# EAGLE schematic AP_Schematic_Final (EAGLE 9.6.2)
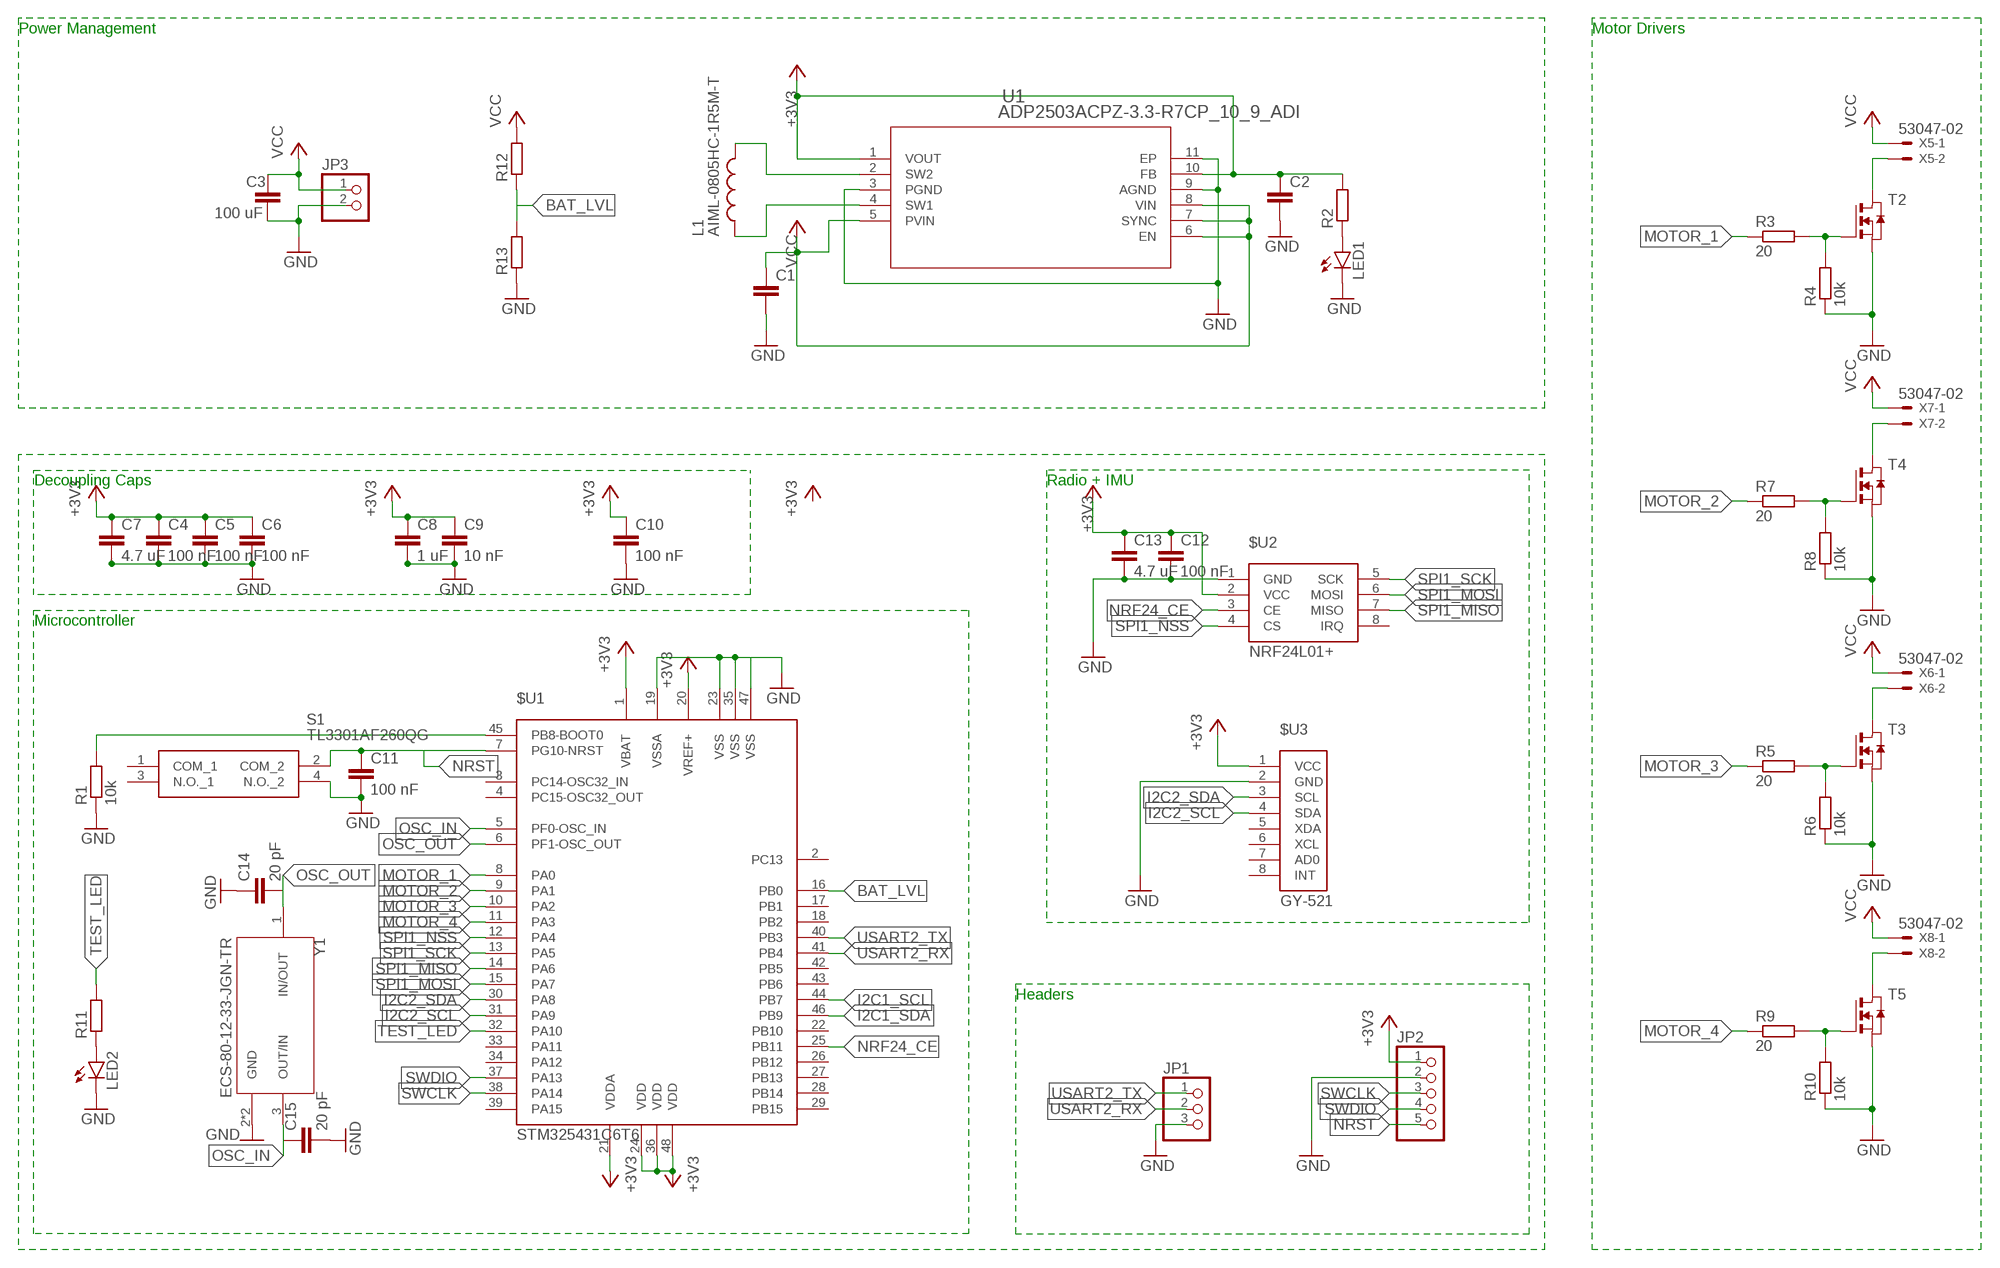
[diagram p0: schematic, sheet 1]

## Parts
$U1  STM325431C6T6  [LQFP48-7X7]
$U2  NRF24L01+  [NRF24L01+]
$U3  GY-521  [GY-521]
C1  C-EUC0603  [C0603]
C2  C-EUC0603  [C0603]
C3  100 uF  C-EUC1206  [C1206]
C4  100 nF  C-EUC0603  [C0603]
C5  100 nF  C-EUC0603  [C0603]
C6  100 nF  C-EUC0603  [C0603]
C7  4.7 uF  C-EUC0603  [C0603]
C8  1 uF  C-EUC0603  [C0603]
C9  10 nF  C-EUC0603  [C0603]
C10  100 nF  C-EUC0603  [C0603]
C11  100 nF  C-EUC0603  [C0603]
C12  100 nF  C-EUC0603  [C0603]
C13  4.7 uF  C-EUC0603  [C0603]
C14  20 pF  C-EUC0603  [C0603]
C15  20 pF  C-EUC0603  [C0603]
JP1  PINHD-1X3  [1X03]
JP2  PINHD-1X5  [1X05]
JP3  PINHD-1X2  [1X02]
L1  AIML-0805HC-1R5M-T  [INDC2012X95N]
LED1  LEDCHIPLED_0603  [CHIPLED_0603]
LED2  LEDCHIPLED_0603  [CHIPLED_0603]
R1  10k  R-EU_R0603  [R0603]
R2  R-EU_R0603  [R0603]
R3  20  R-EU_R0603  [R0603]
R4  10k  R-EU_R0603  [R0603]
R5  20  R-EU_R0603  [R0603]
R6  10k  R-EU_R0603  [R0603]
R7  20  R-EU_R0603  [R0603]
R8  10k  R-EU_R0603  [R0603]
R9  20  R-EU_R0603  [R0603]
R10  10k  R-EU_R0603  [R0603]
R11  R-EU_R0603  [R0603]
R12  R-EU_R0603  [R0603]
R13  R-EU_R0603  [R0603]
S1  TL3301AF260QG  [TL3301AF260QG]
T2  NMOSSOT23  [SOT-23]
T3  NMOSSOT23  [SOT-23]
T4  NMOSSOT23  [SOT-23]
T5  NMOSSOT23  [SOT-23]
U1  ADP2503ACPZ-3.3-R7CP_10_9_ADI  [CP_10_9_ADI]
X5  53047-02  [53047-02]
X6  53047-02  [53047-02]
X7  53047-02  [53047-02]
X8  53047-02  [53047-02]
Y1  ECS-80-12-33-JGN-TR  [XTAL_ECS-240-8-33-AGN-TR]

## Nets
+3V3: $U1.1(VBAT) $U1.20(VREF+) $U1.21(VDDA) $U1.24(VDD) $U1.36(VDD) $U1.48(VDD) $U2.2(VCC) $U3.1(VCC) C2.1 C4.1 C5.1 C6.1 C7.1 C8.1 C9.1 C10.1 C12.1 C13.1 JP2.1 R2.2 U1.1(VOUT) U1.10(FB)
BAT_LVL: $U1.16(PB0) R12.1 R13.2
GND: $U1.19(VSSA) $U1.23(VSS) $U1.35(VSS) $U1.47(VSS) $U3.2(GND) C1.2 C2.2 C3.2 C4.2 C5.2 C6.2 C7.2 C8.2 C9.2 C10.2 C11.2 C14.1 C15.2 JP1.3 JP2.2 JP3.2 LED1.C LED2.C R1.1 R4.1 R6.1 R8.1 R10.1 R13.1 S1.4(N.O._2) T2.2(S) T3.2(S) T4.2(S) T5.2(S) U1.3(PGND) U1.9(AGND) U1.11(EP) Y1.2(GND) Y1.4(GND)
I2C1_SCL: $U1.44(PB7)
I2C1_SDA: $U1.46(PB9)
I2C2_SCL: $U1.31(PA9) $U3.4(SDA)
I2C2_SDA: $U1.30(PA8) $U3.3(SCL)
MOTOR_1: $U1.8(PA0) R3.1
MOTOR_2: $U1.9(PA1) R7.1
MOTOR_3: $U1.10(PA2) R5.1
MOTOR_4: $U1.11(PA3) R9.1
N$1: $U1.45(PB8-BOOT0) R1.2
N$2: L1.2 U1.2(SW2)
N$3: L1.1 U1.4(SW1)
N$4: T2.1(D) X5.2
N$5: $U2.1(GND) C12.2 C13.2 ; supply symbol labelled GND
N$6: LED1.A R2.1
N$7: R3.2 R4.2 T2.3(G)
N$8: LED2.A R11.1
N$9: T3.1(D) X6.2
N$10: R5.2 R6.2 T3.3(G)
N$12: T4.1(D) X7.2
N$13: R7.2 R8.2 T4.3(G)
N$15: T5.1(D) X8.2
N$16: R9.2 R10.2 T5.3(G)
NRF24_CE: $U1.25(PB11) $U2.3(CE)
NRST: $U1.7(PG10-NRST) C11.1 JP2.5 S1.2(COM_2)
OSC_IN: $U1.5(PF0-OSC_IN) C15.1 Y1.3(OUT/IN)
OSC_OUT: $U1.6(PF1-OSC_OUT) C14.2 Y1.1(IN/OUT)
SPI1_MISO: $U1.14(PA6) $U2.7(MISO)
SPI1_MOSI: $U1.15(PA7) $U2.6(MOSI)
SPI1_NSS: $U1.12(PA4) $U2.4(CS)
SPI1_SCK: $U1.13(PA5) $U2.5(SCK)
SWCLK: $U1.38(PA14) JP2.3
SWDIO: $U1.37(PA13) JP2.4
TEST_LED: $U1.32(PA10) R11.2
USART2_RX: $U1.41(PB4) JP1.2
USART2_TX: $U1.40(PB3) JP1.1
VCC: C1.1 C3.1 JP3.1 R12.2 U1.5(PVIN) U1.6(EN) U1.7(SYNC) U1.8(VIN) X5.1 X6.1 X7.1 X8.1
Unconnected: $U1.2(PC13) $U1.3(PC14-OSC32_IN) $U1.4(PC15-OSC32_OUT) $U1.17(PB1) $U1.18(PB2) $U1.22(PB10) $U1.26(PB12) $U1.27(PB13) $U1.28(PB14) $U1.29(PB15) $U1.33(PA11) $U1.34(PA12) $U1.39(PA15) $U1.42(PB5) $U1.43(PB6) $U2.8(IRQ) $U3.5(XDA) $U3.6(XCL) $U3.7(AD0) $U3.8(INT) S1.1(COM_1) S1.3(N.O._1)

## Notes on the sheet
- Power Management | Motor Drivers
- Decoupling Caps | Radio + IMU
- Microcontroller
- Headers

## Library data of the parts
$U1 = AP v1:STM325431C6T6: STM32G431C6T6 Microcontroller Datasheet <https://www.st.com/resource/en/datasheet/stm32g431c6.pdf>
$U2 = AP v1:NRF24L01+: NRF24L01+ Datasheet <https://www.mouser.com/datasheet/2/297/nRF24L01_Product_Specification_v2_0-9199.pdf>
$U3 = AP v1:GY-521: MPU6050 Datasheet <https://invensense.tdk.com/wp-content/uploads/2015/02/MPU-6000-Datasheet1.pdf> MPU6050 Register Map <https://invensense.tdk.com/wp-content/uploads/2015/02/MPU-6000-Datasheet1.pdf>
C1-C15 = rcl:C-EU: CAPACITOR, European symbol; SPICEPREFIX: C
JP1 = pinhead:PINHD-1X3: PIN HEADER
JP2 = pinhead:PINHD-1X5: PIN HEADER
JP3 = pinhead:PINHD-1X2: PIN HEADER
L1 = AIML-0805HC-1R5M-T:AIML-0805HC-1R5M-T: FIXED IND 1.5UH 1.3A 160 MOHM; DESCRIPTION: 1.5 µH Shielded Multilayer Inductor 1.3 A 160mOhm 0805 (2012 Metric); DIGI-KEY_PART_NUMBER: 535-12788-1-ND; MF: Abracon; MP: AIML-0805HC-1R5M-T; PACKAGE: 2012 Abracon; PURCHASE-URL: https://pricing.snapeda.com/search/part/AIML-0805HC-1R5M-T/?ref=eda
LED1 LED2 = led:LED: LED OSRAM: - CHIPLED LG R971, LG N971, LY N971, LG Q971, LY Q971, LO R971, LY R971 LH N974, LH R974 LS Q976, LO Q976, LY Q976 LO Q996 - Hyper CHIPLED LW Q18S LB Q993, LB Q99A, LB R99A - SideLED LS A670, LO A670, LY A670, LG A670, LP A670 LB A673, LV A673, LT A673, LW A673 LH A674 LY A675 LS A676, LA A676, LO A676, LY A676, LW A676 LS A679, LY A679, LG A679 - Hyper Micro SIDELED® LS Y876, LA Y876, LO Y876, LY Y876 LT Y87S - SmartLED LW L88C, LW L88S LB L89C, LB L89S, LG L890 LS L89K, LO L89K, LY L89K LS L896, LA L896, LO L896, LY L896 - TOPLED LS T670, LO T670, LY T670, LG T670, LP T670 LSG T670, LSP T670, LSY T670, LOP T670, LYG T670 LG T671, LOG T671, LSG T671 LB T673, LV T673, LT T673, LW T673 LH T674 LS T676, LA T676, LO T676, LY T676, LB T676, LH T676, LSB T676, LW T676 LB T67C, LV T67C, LT T67C, LS T67K, LO T67K, LY T67K, LW E67C LS E67B, LA E67B, LO E67B, LY E67B, LB E67C, LV E67C, LT E67C LW T67C LS T679, LY T679, LG T679 LS T770, LO T770, LY T770, LG T770, LP T770 LB T773, LV T773, LT T773, LW T773 LH T774 LS E675, LA E675, LY E675, LS T675 LS T776, LA T776, LO T776, LY T776, LB T776 LHGB T686 LT T68C, LB T68C - Hyper Mini TOPLED® LB M676 - Mini TOPLED Santana® LG M470 LS M47K, LO M47K, LY M47K Source: http://www.osram.convergy.de LUXEON: - LUMILED® LXK2-PW12-R00, LXK2-PW12-S00, LXK2-PW14-U00, LXK2-PW14-V00 LXK2-PM12-R00, LXK2-PM12-S00, LXK2-PM14-U00 LXK2-PE12-Q00, LXK2-PE12-R00, LXK2-PE12-S00, LXK2-PE14-T00, LXK2-PE14-U00 LXK2-PB12-K00, LXK2-PB12-L00, LXK2-PB12-M00, LXK2-PB14-N00, LXK2-PB14-P00, LXK2-PB14-Q00 LXK2-PR12-L00, LXK2-PR12-M00, LXK2-PR14-Q00, LXK2-PR14-R00 LXK2-PD12-Q00, LXK2-PD12-R00, LXK2-PD12-S00 LXK2-PH12-R00, LXK2-PH12-S00 LXK2-PL12-P00, LXK2-PL12-Q00, LXK2-PL12-R00 Source: www.luxeon.com KINGBRIGHT: KA-3528ASYC Source: www.kingbright.com
R1-R13 = rcl:R-EU_: RESISTOR, European symbol; SPICEPREFIX: R
S1 = TL3301AF260QG:TL3301AF260QG: E-SWITCH - TL3301AF260QG - SWITCH, TACTILE SPST 50mA, SMD GULL WING Source: Datasheet <https://componentsearchengine.com/Datasheets/1/TL3301AF260QG.pdf>; DESCRIPTION: Tactile Switch SPST-NO Top Actuated Surface Mount; DIGI-KEY_PART_NUMBER: EG2527CT-ND; MF: E-Switch; MP: TL3301AF260QG; PACKAGE: None; PURCHASE-URL: https://pricing.snapeda.com/search/part/TL3301AF260QG/?ref=eda
T2-T5 = zetex:NMOSSOT23: MOS FET; OC_FARNELL: unknown; OC_NEWARK: unknown
U1 = 2022-01-13_17-21-51_Library:ADP2503ACPZ-3.3-R7; COPYRIGHT: Copyright (C) 2022 Ultra Librarian. All rights reserved.; DIGI-KEY_PART_NUMBER_1: ADP2503ACPZ-3.3-R7CT-ND; DIGI-KEY_PART_NUMBER_2: ADP2503ACPZ-3.3-R7DKR-ND; DIGI-KEY_PART_NUMBER_3: ADP2503ACPZ-3.3-R7TR-ND; DIGI-KEY_PART_NUMBER_4: 2156-ADP2503ACPZ-3.3-R7-ND; MANUFACTURER_PART_NUMBER: ADP2503ACPZ-3.3-R7; MFR_NAME: Analog Devices Inc
X5-X8 = AP v1:53?-02: CONNECTOR wire to board 1.25 mm (.049 inch) pitch header; MF: MOLEX; MPN: 53047-0210; OC_FARNELL: 9733051; OC_NEWARK: 57H4701
Y1 = ECS-80-12-33-JGN-TR:ECS-80-12-33-JGN-TR: The sub miniature ECX-32 is a compact SMD Crystal. The 3.2 x 2.5 x 0.8 mm ceramic package is ideal for today’s SMD manufacturing environment.; DESCRIPTION: 8 MHz ±20ppm Crystal 12pF 400 Ohms 4-SMD, No Lead; DIGI-KEY_PART_NUMBER: 50-ECS-80-12-33-JGN-CT-ND; MF: ECS Inc.; MP: ECS-80-12-33-JGN-TR; PACKAGE: SMD-4 ECS International; PURCHASE-URL: https://pricing.snapeda.com/search/part/ECS-80-12-33-JGN-TR/?ref=eda